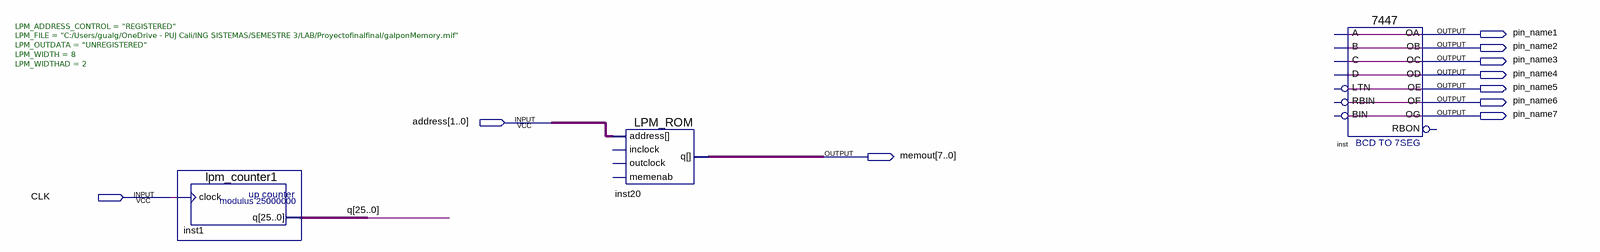
[diagram p0: schematic sheet]
// Quartus schematic pruebamem.bdf as structural Verilog: 3 symbols, 10 pins
module pruebamem (
  input  [1:0] address,
  input  CLK,
  output pin_name1,
  output pin_name2,
  output pin_name3,
  output pin_name4,
  output pin_name5,
  output pin_name6,
  output pin_name7,
  output [7:0] memout
);

  wire [25:0] q;

  lpm_counter1 inst1 (.clock(CLK), .q(q));
  LPM_ROM #(.LPM_ADDRESS_CONTROL("REGISTERED"), .LPM_FILE("C:/Users/gualg/OneDrive - PUJ Cali/ING SISTEMAS/SEMESTRE 3/LAB/Proyectofinalfinal/galponMemory.mif"), .LPM_OUTDATA("UNREGISTERED"), .LPM_WIDTH(8), .LPM_WIDTHAD(2)) inst20 (
    .address(address), .q(memout));  // open: inclock, outclock, memenab
  \7447  inst (
    .OB(pin_name2), .OC(pin_name3), .OE(pin_name5), .OD(pin_name4), .OF(pin_name6), .OG(pin_name7),
    .OA(pin_name1));  // open: LTN, B, C, D, RBIN, BIN, A, RBON
endmodule
